# Altium schematic sheet Power.SchDoc: ZStation Power
size A4; Engineer: Stephan Eersels; DocumentNumber: 12202925_ZS; Revision: 2.1; SheetNumber: 2; SheetTotal: 9
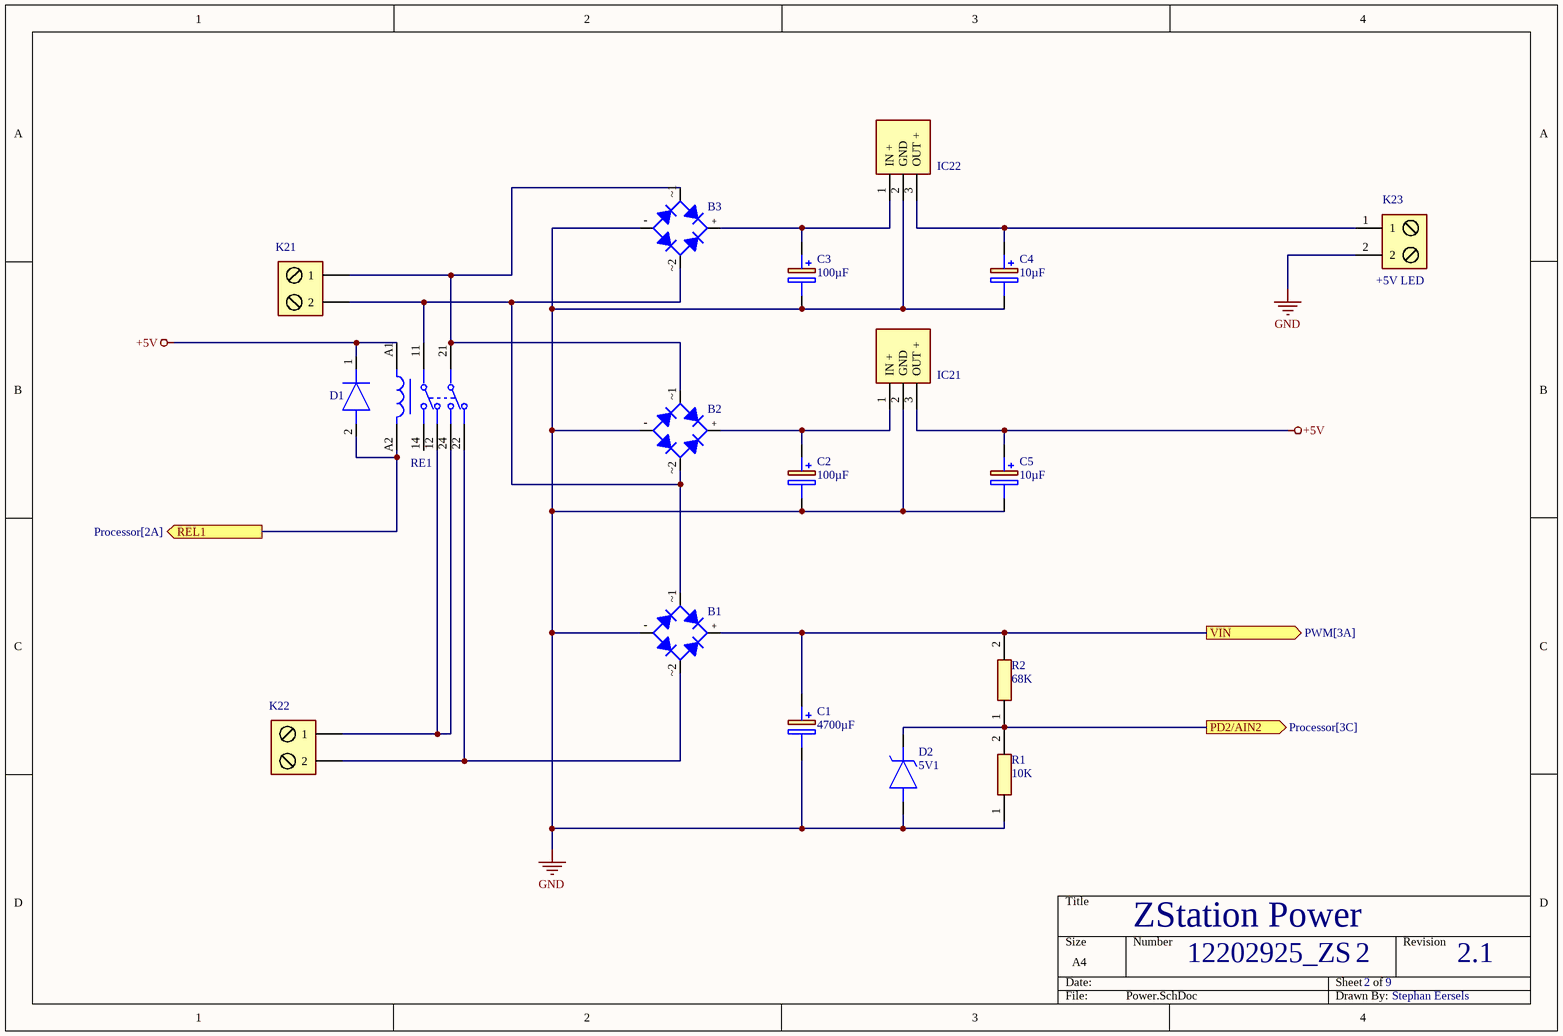
[diagram p0: Power.SchDoc]

## Parts
B1  Bridge_Classic  [GBU6JE345]  (value not drawn)
B2  Bridge_Classic  [GBU6JE345]  (value not drawn)
B3  Bridge_Classic  [GBU6JE345]  (value not drawn)
C1  4700µF  [CAPPRD250W52D630H1250]
C2  100µF  [CAPPRD250W52D630H1250]
C3  100µF  [CAPPRD250W52D630H1250]
C4  10µF  [CAPPRD250W52D630H1250]
C5  10µF  [CAPPRD250W52D630H1250]
D1  (no value)  [1N4007]
D2  5V1  [DIOAD950W60L350D150]
IC21  OKI-78SR-5_1.5-W36-C  [OKI78SR515W36C]  (value not drawn)
IC22  OKI-78SR-5_1.5-W36-C  [OKI78SR515W36C]  (value not drawn)
K21  TBLOCK_2P  [TBLOCK_2P]  (value not drawn)
K22  TBLOCK_2P  [TBLOCK_2P]  (value not drawn)
K23  +5V LED  [TBLOCK_2P]
R1  10K  [VISHAY_CMF_60]
R2  68K  [VISHAY_CMF_60]
RE1  RELAY_GENERAL_PURPOSE  [RT424005F]  (value not drawn)

## Ports
PD2/AIN2 (out, see Processor[3C]), REL1 (out, see Processor[2A]), VIN (out, see PWM[3A])

## Nets
+5V: C5.1(+) D1.1(K) IC21.3(OUT_+) RE1.A1
GND: B1.-(A) B2.-(A) B3.-(A) C1.2(-) C2.2(-) C3.2(-) C4.2(-) C5.2(-) D2.2(A) IC21.2(GND) IC22.2(GND) K23.2 R1.1
PD2/AIN2: D2.1(K) R1.2 R2.1 ; port PD2/AIN2
REL1: D1.2(A) RE1.A2 ; port REL1
VIN: B1.+(K) C1.1(+) R2.2 ; port VIN
NetB1_~1: B1.~1(C) B2.~2(C) B3.~2(C) K21.2 RE1.11
NetB1_~2: B1.~2(C) K22.2 RE1.22
NetB2_+: B2.+(K) C2.1(+) IC21.1(IN_+)
NetB2_~1: B2.~1(C) B3.~1(C) K21.1 RE1.21
NetB3_+: B3.+(K) C3.1(+) IC22.1(IN_+)
NetC4_1: C4.1(+) IC22.3(OUT_+) K23.1
NetK22_1: K22.1 RE1.12 RE1.24

Not connected (* = marked no-connect by the designer): RE1 14

## Library data of the parts
B1-B3 = Bridge_Classic: Bridge Rectifiers 6.0 Amp 600 Volt; Manufacturer: Diodes Inc; Average Rectified Current-Max: 0.8A; Reverse Voltage-Max [Vrrm]: 600V; Forward Voltage: 1V; Peak Current-Max: 30A; Reverse Current-Max: 5µA; Package Version: 05/2016; Package URL: http://www.diodes.com/_files/packages/MiniDIP.pdf; Datasheet Version: Rev. 13-2, 12/2010; Datasheet URL: http://www.diodes.com/_files/datasheets/ds17003.pdf; Mounting Technology: SurfaceMount; Manufacturer URL: http://www.diodes.com/; Package Reference: MiniDIP-4; Package Description: 4-Pin Small Outline Integrated Circuit, Body 4.7 x 3.8 mm, Pitch 2.5 mm
C1 = CAP_4700µF_50V: Aluminium Electrolytic Capacitors - Radial Leaded WCAP-ATG8 4700uF 50V 20% Radial; Manufacturer_Name: Wurth Elektronik; Manufacturer_Part_Number: 860040473003; Datasheet Link: https://componentsearchengine.com/Datasheets/2/860040473003.pdf; Height: 12.5mm; Mouser Part Number: 710-860040473003; Mouser Price/Stock: https://www.mouser.co.uk/ProductDetail/Wurth-Elektronik/860040473003?qs=0KOYDY2FL29v2%2FALxGsSIw%3D%3D
C2 C3 = CAP_100µF_25V: Aluminium Electrolytic Capacitors - Radial Leaded WCAP-ATUL 100uF 25V 20% Radial; Manufacturer_Name: Wurth Elektronik; Manufacturer_Part_Number: 860040473003; Datasheet Link: https://componentsearchengine.com/Datasheets/2/860040473003.pdf; Height: 12.5mm; Mouser Part Number: 710-860040473003; Mouser Price/Stock: https://www.mouser.co.uk/ProductDetail/Wurth-Elektronik/860040473003?qs=0KOYDY2FL29v2%2FALxGsSIw%3D%3D
C4 C5 = CAP_10µF_50V: Aluminium Electrolytic Capacitors - Radial Leaded WCAP-AT1H 10uF 50V 20% Radial; Manufacturer_Name: Wurth Elektronik; Manufacturer_Part_Number: 860040473003; Datasheet Link: https://componentsearchengine.com/Datasheets/2/860040473003.pdf; Height: 12.5mm; Mouser Part Number: 710-860040473003; Mouser Price/Stock: https://www.mouser.co.uk/ProductDetail/Wurth-Elektronik/860040473003?qs=0KOYDY2FL29v2%2FALxGsSIw%3D%3D
D1 = 1N4007: Diode 1N4007; Manufacturer_Name: Diotec; Datasheet Link: https://diotec.com/tl_files/diotec/files/pdf/datasheets/1n4001.pdf; Manufacturer_Part_Number: 1N4007; Mouser Part Number: 637-1N4007; Mouser Price/Stock: https://www.mouser.co.uk/ProductDetail/Diotec-Semiconductor/1N4007?qs=OlC7AqGiEDmK9mU1uTiCkg%3D%3D; Arrow Part Number: 1N4007; Arrow Price/Stock: https://www.arrow.com/en/products/1n4007/diotec-semiconductor-ag?region=europe
D2 = ZEN_5V1_TH: Zener Diode 5.1 Volt 0.5W 5%; Manufacturer_Name: Vishay; Manufacturer_Part_Number: TZX5V1B-TR; Datasheet Link: https://componentsearchengine.com/Datasheets/1/TZX5V1B-TR.pdf; Mouser Part Number: 78-TZX5V1B; Mouser Price/Stock: https://www.mouser.co.uk/ProductDetail/Vishay-Semiconductors/TZX5V1B-TR?qs=25SNtymhSqO6Jh%252BHM6pQoA%3D%3D; Arrow Part Number: TZX5V1B-TR; Arrow Price/Stock: https://www.arrow.com/en/products/tzx5v1b-tr/vishay?region=nac
IC21 IC22 = OKI-78SR-5_1.5-W36-C: Non-Isolated DC/DC Converter 7.5W 12VIN 5VOUT 1.5A DC/DC; Manufacturer_Name: Murata Electronics; Manufacturer_Part_Number: OKI-78SR-5/1.5-W36-C; Datasheet Link: https://www.murata.com/products/productdata/8807037992990/oki-78sr.pdf?1583754815000; Height: 16.5mm; Mouser Part Number: 580-OKI78SR5/1.5W36C; Mouser Price/Stock: https://www.mouser.co.uk/ProductDetail/Murata-Power-Solutions/OKI-78SR-5-1.5-W36-C?qs=uJpRT2lXVNXJP%252Bo08dQqJQ%3D%3D; Arrow Part Number: OKI-78SR-5/1.5-W36-C; Arrow Price/Stock: https://www.arrow.com/en/products/oki-78sr-51.5-w36-c/murata-power-solutions?region=nac
K21-K23 = TBLOCK_2P: Connector; Manufacturer_Name: Wurth Elektronik; Manufacturer_Part_Number: 691104700002; Height: 7.7mm; Mouser Part Number: 710-691104700002; Mouser Price/Stock: https://www.mouser.co.uk/ProductDetail/Wurth-Elektronik/691104700002?qs=sPbYRqrBIVlxnZf2zP2Y8g%3D%3D
R1 R2 = RES_68K_10K: Through Hole 1W 10/68 Kohms 1%; Manufacturer_Name: Vishay; Manufacturer_Part_Number: CMF6010K000FKEB; Datasheet Link: https://datasheet.datasheetarchive.com/originals/distributors/Datasheets-DGA8/3123891.pdf; Mouser Part Number: 71-CMF6010K000FKEB; Mouser Price/Stock: https://www.mouser.co.uk/ProductDetail/Vishay-Dale/CMF6010K000FKEB?qs=GEEnpASSx%2Fgpk8SPxIuFzw%3D%3D; Arrow Part Number: CMF6010K000FKEB; Arrow Price/Stock: https://www.arrow.com/en/products/cmf6010k000fkeb/vishay
RE1 = RELAY_GENERAL_PURPOSE: Manufacturer Part Number: RT424005; Manufacturer: TE Connectivity; Coil Power: 403mW; Throw Configuration: DPDT; Coil Voltage: 5V; Number Of Contacts: 2; Coil Resistance: 62Ω; Current Rating: 8A; Coil Type: Non-Latching; Category: Relay; Octopart: https://octopart.com/5-1393243-9-te+connectivity-41835766; Device Class L3: Power Relays; ComponentLink2URL: https://www.te.com/commerce/DocumentDelivery/DDEController?Action=showdoc&DocId=Data+Sheet%7FRT2%7F1014%7Fpdf%7FEnglish%7FENG_DS_RT2_1014.pdf%7F5-1393243-9; Ambient Temperature Range High: +85°C; ComponentLink2Description: Datasheet; Digikey Description: RELAY GENERAL PURPOSE DPDT 8A 5V; Package: RT424005; Automotive: No; Device Class L1: Electromechanical; Height: 15.7mm; Device Class L2: Relays; Ambient Temperature Range Low: -40°C; Mouser Description: General Purpose Relay, Rt2 Series, Power, Non Latching, Dpdt, 5 Vdc, 8 A Rohs Compliant: Yes; Lead Free: Yes; RoHS: TRUE